# EAGLE schematic i-uC (EAGLE 5.07)
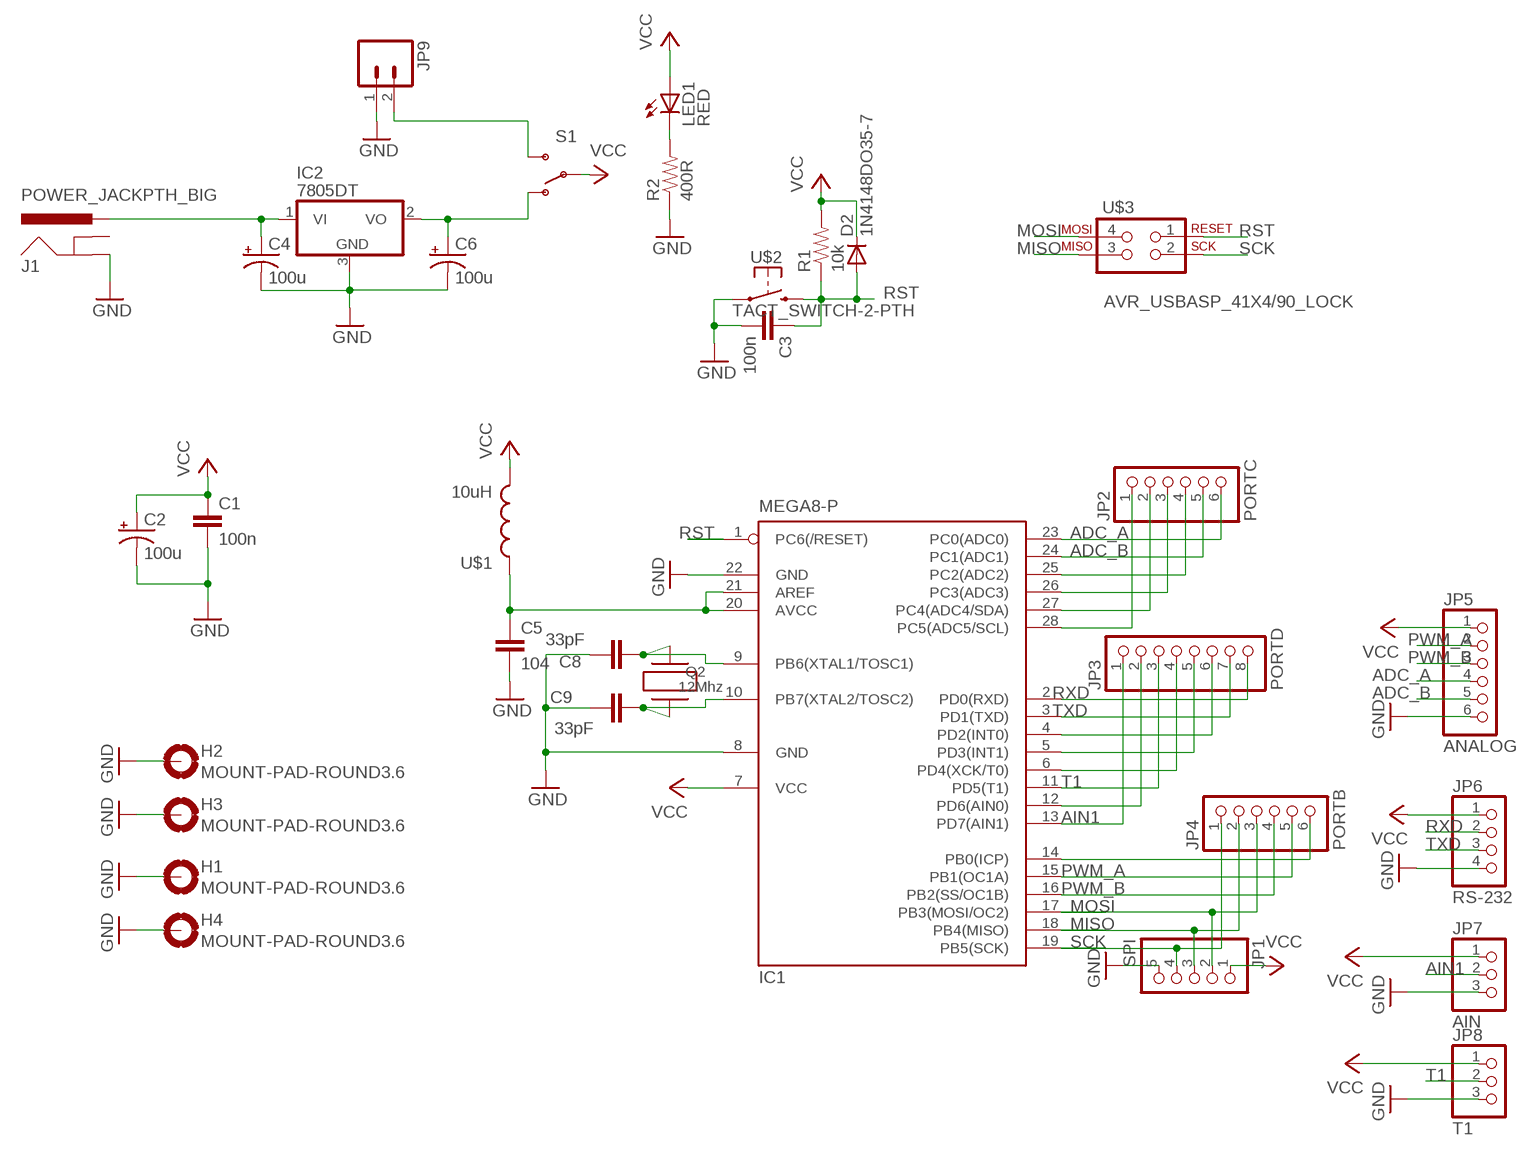
[diagram p0: schematic, sheet 1]

## Parts
C1  100n  CAP0805  [0805]
C2  100u  CAP_POLD  [PANASONIC_D]
C3  100n  CAP0805  [0805]
C4  100u  CAP_POLD  [PANASONIC_D]
C5  104  CAPPTH  [CAP-PTH-SMALL]
C6  100u  CAP_POLD  [PANASONIC_D]
C8  33pF  CAP0805  [0805]
C9  33pF  CAP0805  [0805]
D2  1N4148DO35-7  DIODE1N4148  [DIODE-1N4148]
H1  MOUNT-PAD-ROUND3.6  [3,6-PAD]
H2  MOUNT-PAD-ROUND3.6  [3,6-PAD]
H3  MOUNT-PAD-ROUND3.6  [3,6-PAD]
H4  MOUNT-PAD-ROUND3.6  [3,6-PAD]
IC1  MEGA8-P  [DIL28-3]
IC2  7805DT  [TO252]
J1  POWER_JACKPTH_BIG  [POWER_JACK_2.1X5.5_BIG_PTH]
JP1  SPI  PINHD-1X5/90  [1X05/90]
JP2  PORTC  PINHD-1X6  [1X06]
JP3  PORTD  PINHD-1X8  [1X08]
JP4  PORTB  PINHD-1X6  [1X06]
JP5  ANALOG  PINHD-1X6/90  [1X06/90]
JP6  RS-232  PINHD-1X4/90_LOCK  [1X04/90_LOCK]
JP7  AIN  PINHD-1X3/90-LOCK  [1X03/90_LOCK]
JP8  T1  PINHD-1X3/90-LOCK  [1X03/90_LOCK]
JP9  CON-02-XH  [XH-1X2-LONG-LOCK]
LED1  RED  LEDCHIP-LED0805  [CHIP-LED0805]
Q2  12Mhz  XTAL  [XTAL]
R1  10k  RESISTOR0805  [0805]
R2  400R  RESISTOR0805  [0805]
S1  SWITCH-SPST3AM6  [SWITCH-SPDT-AM#6]
U$1  10uH  INDUCTOR1/4W-SIZE  [0204/7]
U$2  TACT_SWITCH-2-PTH  [ALPS-SKHV]
U$3  AVR_USBASP_41X4/90_LOCK  [1X04/90_LOCK]

## Nets
ADC_A: IC1.23(PC0(ADC0)) JP2.6 JP5.4
ADC_B: IC1.24(PC1(ADC1)) JP2.5 JP5.5
AIN1: IC1.13(PD7(AIN1)) JP3.1 JP7.2
AVCC: C5.1 IC1.20(AVCC) IC1.21(AREF) U$1.1
GND: C1.2 C2.- C3.2 C4.- C5.2 C6.- C8.2 C9.2 H1.B3,6(MOUNT) H2.B3,6(MOUNT) H3.B3,6(MOUNT) H4.B3,6(MOUNT) IC1.8(GND) IC1.22(GND) IC2.3(GND) J1.GND JP1.5 JP5.6 JP6.4 JP7.3 JP8.3 JP9.1 R2.1 U$2.2
MISO: IC1.18(PB4(MISO)) JP1.3 JP4.2 U$3.3
MOSI: IC1.17(PB3(MOSI/OC2)) JP1.2 JP4.3 U$3.4
N$1: C6.+ IC2.2(VO) S1.1(O)
N$2: C9.1 IC1.10(PB7(XTAL2/TOSC2)) Q2.1
N$3: JP9.2 S1.3(S)
N$4: LED1.C R2.2
N$5: C4.+ IC2.1(VI) J1.PWR
N$8: IC1.25(PC2(ADC2)) JP2.4
N$9: IC1.26(PC3(ADC3)) JP2.3
N$10: IC1.27(PC4(ADC4/SDA)) JP2.2
N$11: IC1.28(PC5(ADC5/SCL)) JP2.1
N$14: IC1.4(PD2(INT0)) JP3.6
N$15: IC1.5(PD3(INT1)) JP3.5
N$16: IC1.6(PD4(XCK/T0)) JP3.4
N$18: IC1.12(PD6(AIN0)) JP3.2
N$20: IC1.14(PB0(ICP)) JP4.6
N$34: C8.1 IC1.9(PB6(XTAL1/TOSC1)) Q2.2
PWM_A: IC1.15(PB1(OC1A)) JP4.5 JP5.2
PWM_B: IC1.16(PB2(SS/OC1B)) JP4.4 JP5.3
RST: C3.1 D2.A IC1.1(PC6(/RESET)) R1.1 U$2.3 U$3.1
RXD: IC1.2(PD0(RXD)) JP3.8 JP6.2
SCK: IC1.19(PB5(SCK)) JP1.4 JP4.1 U$3.2
T1: IC1.11(PD5(T1)) JP3.3 JP8.2
TXD: IC1.3(PD1(TXD)) JP3.7 JP6.3
VCC: C1.1 C2.+ D2.C IC1.7(VCC) JP1.1 JP5.1 JP6.1 JP7.1 JP8.1 LED1.A R1.2 S1.2(P) U$1.2
Unconnected: J1.GNDBREAK

## Library data of the parts
C1 C5 = SparkFun:CAP: Capacitor Standard 0603 ceramic capacitor, and 0.1" leaded capacitor.
C2 C4 C6 = digital-toy:CAP_POL: Capacitor Polarized These are standard SMD and PTH capacitors. Normally 10uF, 47uF, and 100uF in electrolytic and tantalum varieties. Always verify the external diameter of the through hole cap, it varies with capacity, voltage, and manufacturer. The EIA devices should be standard.
C3 C8 C9 = digital-toy:CAP: Capacitor Standard 0603 ceramic capacitor, and 0.1" leaded capacitor.
D2 = digital-toy:DIODE: Diode These are standard reverse protection diodes and small signal diodes. SMA package can handle up to about 1A. SOD-323 can handle about 200mA. What the SOD-323 package when ordering, there are some mfgs out there that are 5-pin packages.
H1-H4 = holes:MOUNT-PAD-ROUND: MOUNTING PAD, round
IC1 = atmel:MEGA8-P: MICROCONTROLLER 8 Kbytes FLASH, 1 kbytes SRAM, 512 bytes EEPROM, USART, 4-channel 10 bit ADC, 2-channel 8 bit ADC Pin compatible with Atmega48, ATMega88, ATMega168 Source: avr.lbr
IC2 = linear:78*: Positive VOLTAGE REGULATOR Source: http://cache.national.com/ds/LM/LM78L05.pdf http://www.fairchildsemi.com/ds/LM/LM7805.pdf
J1 = digital-toy:POWER_JACK: Power Jack This is the standard 5.5mm barrel jack for power. The PTH is the most common, proven, reliable, footprint. All others are experimental. The Slot footprint only works if the mill layer is transmitted to the PCB fab house so be warned. Spark Fun Electronics SKU : PRT-00119. Mating wall wart : TOL-00298 (and others)
JP1 = pinhead:PINHD-1X5: PIN HEADER
JP2 JP4 JP5 = pinhead:PINHD-1X6: PIN HEADER
JP3 = pinhead:PINHD-1X8: PIN HEADER
JP6 = digital-toy:PINHD-1X4: PIN HEADER
JP7 JP8 = digital-toy:PINHD-1X3: PIN HEADER
JP9 = digital-toy:CON-02: Header 2 Standard 2-pin 0.1" header. Use with straight break away headers (SKU : PRT-00116), right angle break away headers (PRT-00553), swiss pins (PRT-00743), machine pins (PRT-00117), and female headers (PRT-00115). Molex polarized connector foot print use with SKU : PRT-08233 with associated crimp pins and housings.
LED1 = led:LED: LED OSRAM: - CHIPLED LG R971, LG N971, LY N971, LG Q971, LY Q971, LO R971, LY R971 LH N974, LH R974 LS Q976, LO Q976, LY Q976 LO Q996 - Hyper CHIPLED LW Q18S LB Q993, LB Q99A, LB R99A - SideLED LS A670, LO A670, LY A670, LG A670, LP A670 LB A673, LV A673, LT A673, LW A673 LH A674 LY A675 LS A676, LA A676, LO A676, LY A676, LW A676 LS A679, LY A679, LG A679 - Hyper Micro SIDELED® LS Y876, LA Y876, LO Y876, LY Y876 LT Y87S - SmartLED LW L88C, LW L88S LB L89C, LB L89S, LG L890 LS L89K, LO L89K, LY L89K LS L896, LA L896, LO L896, LY L896 - TOPLED LS T670, LO T670, LY T670, LG T670, LP T670 LSG T670, LSP T670, LSY T670, LOP T670, LYG T670 LG T671, LOG T671, LSG T671 LB T673, LV T673, LT T673, LW T673 LH T674 LS T676, LA T676, LO T676, LY T676, LB T676, LH T676, LSB T676, LW T676 LB T67C, LV T67C, LT T67C, LS T67K, LO T67K, LY T67K, LW E67C LS E67B, LA E67B, LO E67B, LY E67B, LB E67C, LV E67C, LT E67C LW T67C LS T679, LY T679, LG T679 LS T770, LO T770, LY T770, LG T770, LP T770 LB T773, LV T773, LT T773, LW T773 LH T774 LS E675, LA E675, LY E675, LS T675 LS T776, LA T776, LO T776, LY T776, LB T776 LHGB T686 LT T68C, LB T68C - Hyper Mini TOPLED® LB M676 - Mini TOPLED Santana® LG M470 LS M47K, LO M47K, LY M47K Source: http://www.osram.convergy.de LUXEON: - LUMILED® LXK2-PW12-R00, LXK2-PW12-S00, LXK2-PW14-U00, LXK2-PW14-V00 LXK2-PM12-R00, LXK2-PM12-S00, LXK2-PM14-U00 LXK2-PE12-Q00, LXK2-PE12-R00, LXK2-PE12-S00, LXK2-PE14-T00, LXK2-PE14-U00 LXK2-PB12-K00, LXK2-PB12-L00, LXK2-PB12-M00, LXK2-PB14-N00, LXK2-PB14-P00, LXK2-PB14-Q00 LXK2-PR12-L00, LXK2-PR12-M00, LXK2-PR14-Q00, LXK2-PR14-R00 LXK2-PD12-Q00, LXK2-PD12-R00, LXK2-PD12-S00 LXK2-PH12-R00, LXK2-PH12-S00 LXK2-PL12-P00, LXK2-PL12-Q00, LXK2-PL12-R00 Source: www.luxeon.com KINGBRIGHT: KA-3528ASYC Source: www.kingbright.com
Q2 = yhf_spec-RF:XTAL
R1 R2 = digital-toy:RESISTOR: Resistor Basic schematic elements and footprints for 0603, 1206, and PTH 1/10th watt (small) resistors. digital-toy copy vertical mount of axial-0.3 from rcl.lbr : the 0207/xx
S1 = digital-toy:SWITCH-SPST: SPST Switch Simple slide switch. Spark Fun Electronics SKU : COM-00102
U$1 = digital-toy:INDUCTOR: Inductors Basic Inductor/Choke - 0603 and 1206. Footprints are not proven and vary greatly between part numbers.
U$2 = digital-toy:TACT_SWITCH-2
U$3 = digital-toy:AVR_USBASP_4: AVR ISP 6 Pin This is the reduced ISP connector for AVR programming. Common on Arduino. This footprint will take up less PCB space and can be used with a 10-pin to 6-pin adapter such as SKU: BOB-08508